# Altium schematic sheet Amplifier.SchDoc
size A4; DocumentNumber: 5; SheetNumber: 5; SheetTotal: 5
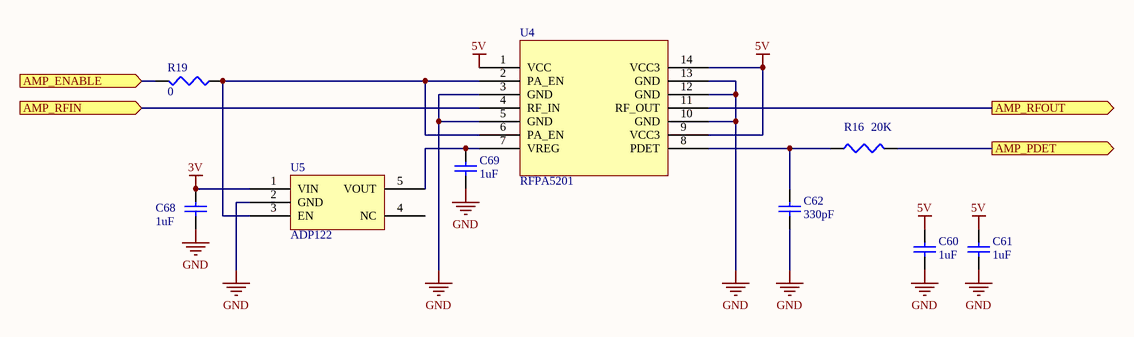
[diagram p0: Amplifier.SchDoc]

## Parts
C60  value 1uF  [1608[0603]]  (hidden comment: Cap Semi)
C61  value 1uF  [1608[0603]]  (hidden comment: Cap Semi)
C62  value 330pF  [1608[0603]]  (hidden comment: Cap Semi)
C68  value 1uF  [1608[0603]]  (hidden comment: Cap Semi)
C69  value 1uF  [1608[0603]]  (hidden comment: Cap Semi)
R16  value 20K  [J1-0603]  (hidden comment: Res3)
R19  value 0  [J1-0603]  (hidden comment: Res3)  (no BOM)
U4  RFPA5201  [MCM14]
U5  ADP122  [SOT23-5AM]

## Ports
AMP_ENABLE (in), AMP_PDET (out), AMP_RFIN (in), AMP_RFOUT (out)

## Nets
3V: C68.2 U5.1(VIN)
5V: C60.2 C61.2 U4.1(VCC) U4.9(VCC3) U4.14(VCC3)
GND: C60.1 C61.1 C62.1 C68.1 C69.1 U4.3(GND) U4.5(GND) U4.10(GND) U4.12(GND) U4.13(GND) U5.2(GND)
AMP_ENABLE: R19.2 ; port AMP_ENABLE
AMP_PDET: R16.2 ; port AMP_PDET
AMP_RFIN: U4.4(RF_IN) ; port AMP_RFIN
AMP_RFOUT: U4.11(RF_OUT) ; port AMP_RFOUT
NetC62_2: C62.2 R16.1 U4.8(PDET)
NetC69_2: C69.2 U4.7(VREG) U5.5(VOUT)
NetR19_1: R19.1 U4.2(PA_EN) U4.6(PA_EN) U5.3(EN)

Not connected (* = marked no-connect by the designer): U5 4(NC)

## Library data of the parts
C60-C62 C68 C69 = Cap Semi: Capacitor (Semiconductor SIM Model); Published: 8-Jun-2000; LatestRevisionDate: 29-May-2009; LatestRevisionNote: IPC-7351 Footprint Added.; PackageReference: C1206; Publisher: Altium Limited; PackageDescription: Chip Capacitor
R16 R19 = Res3: Resistor; Published: 8-Jun-2000; LatestRevisionDate: 29-May-2009; LatestRevisionNote: IPC-7351 Footprint Added.; PackageReference: J1-0603; Publisher: Altium Limited; PackageDescription: Chip Resistor
U4 = RFPA5201: WiFi Power Amplifier Module
U5 = ADP122: 2.9V LDO